# EAGLE design ir_imu (EAGLE 4.16)
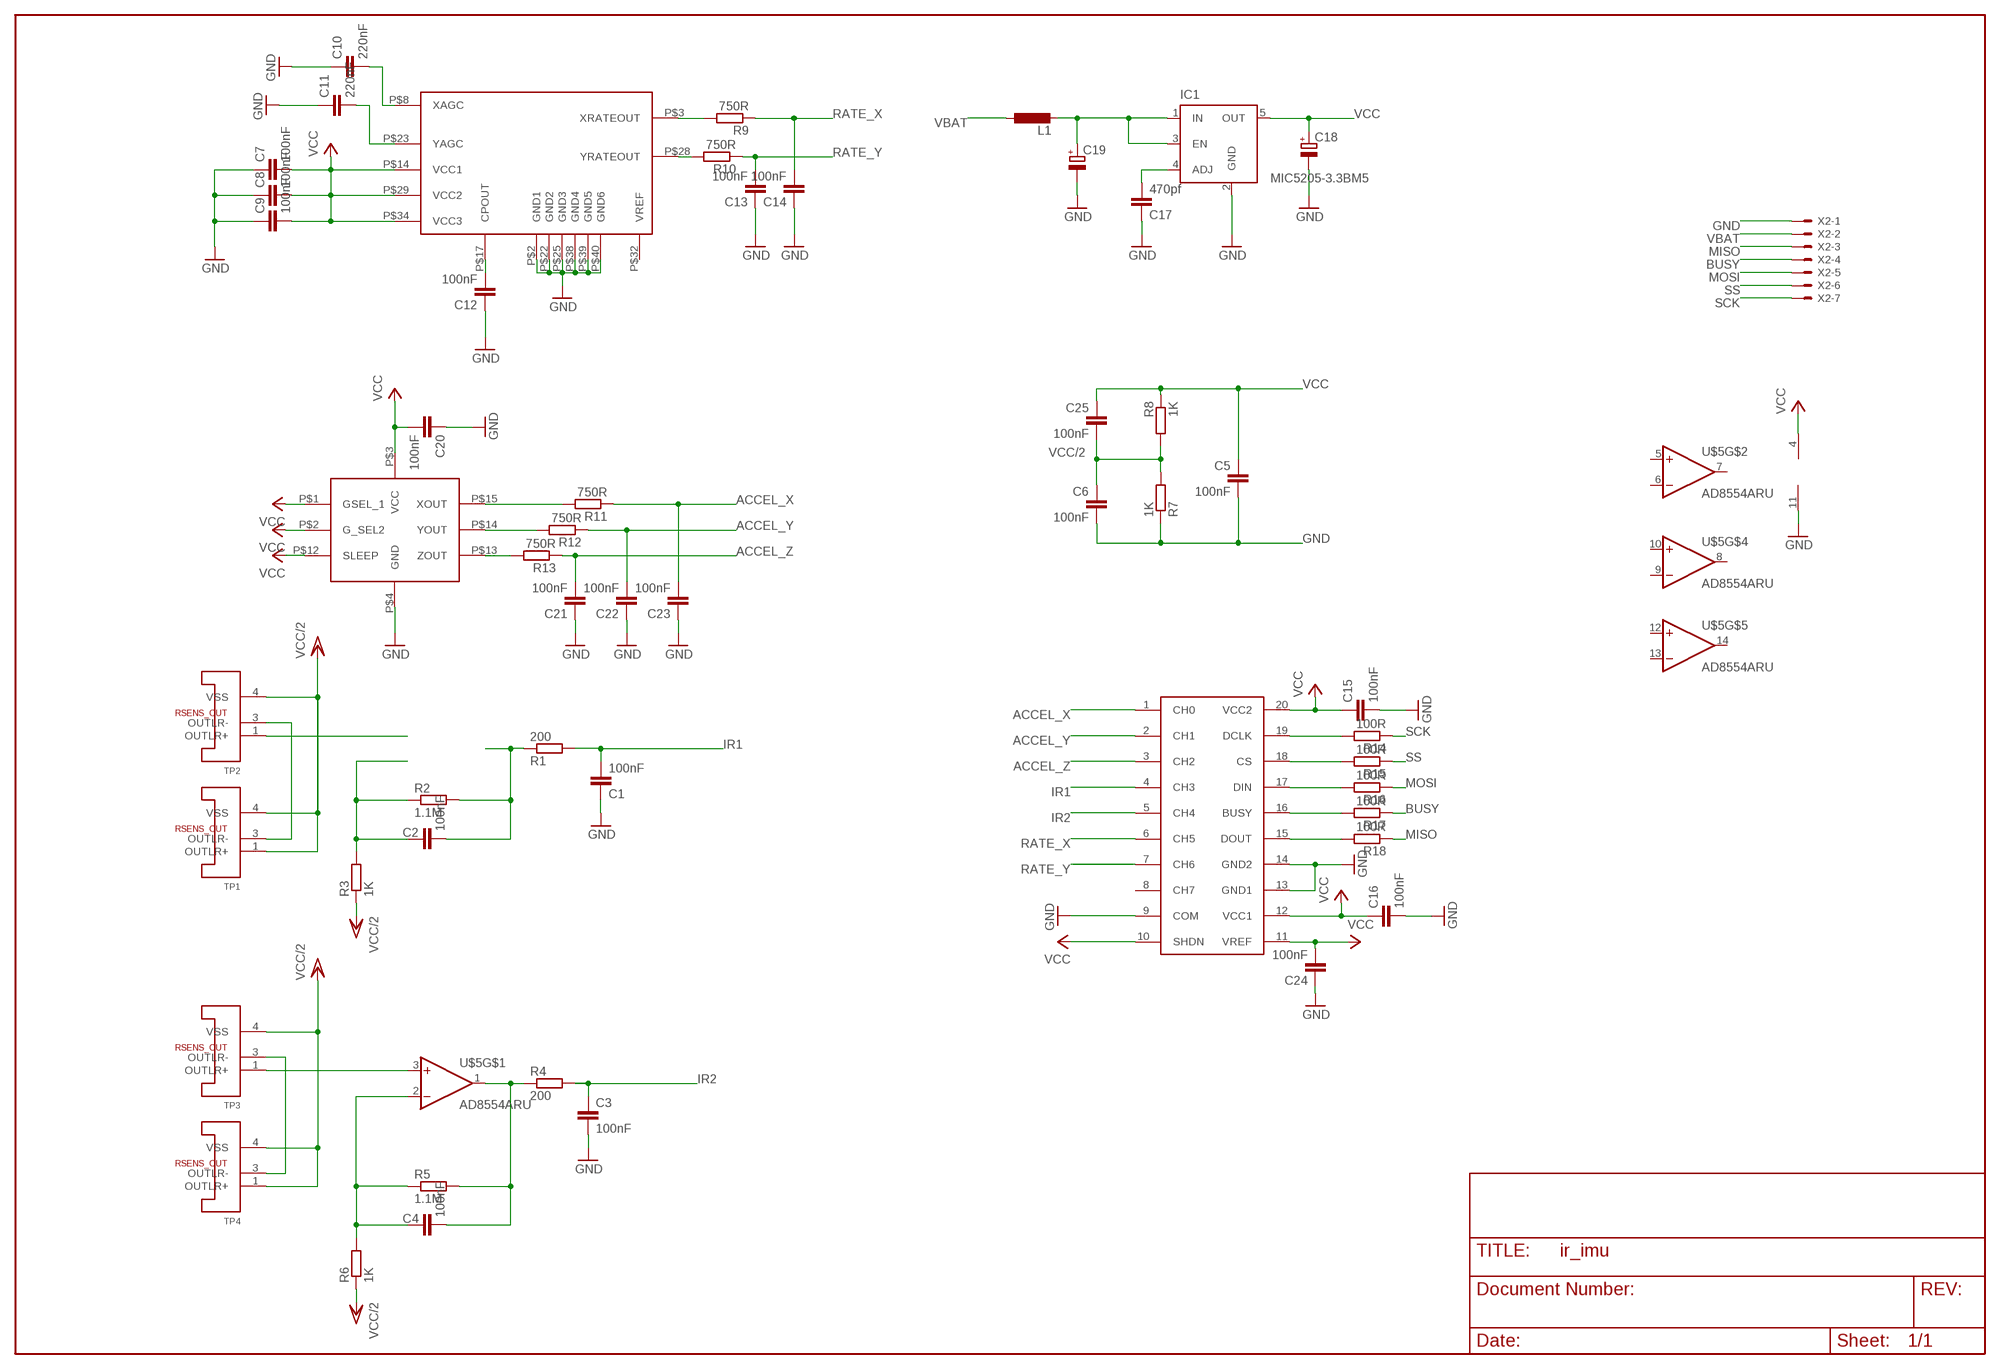
[diagram p0: schematic, sheet 1]

## Parts
C1  100nF  C-EUC0402K  [C0402K]
C2  100nF  C-EUC0402K  [C0402K]
C3  100nF  C-EUC0402K  [C0402K]
C4  100nF  C-EUC0402K  [C0402K]
C5  100nF  C-EUC0402K  [C0402K]
C6  100nF  C-EUC0402K  [C0402K]
C7  100nF  C-EUC0402K  [C0402K]
C8  100nF  C-EUC0402K  [C0402K]
C9  100nF  C-EUC0402K  [C0402K]
C10  220nF  C-EUC0402K  [C0402K]
C11  220nF  C-EUC0402K  [C0402K]
C12  100nF  C-EUC0402K  [C0402K]
C13  100nF  C-EUC0402K  [C0402K]
C14  100nF  C-EUC0402K  [C0402K]
C15  100nF  C-EUC0402K  [C0402K]
C16  100nF  C-EUC0402K  [C0402K]
C17  470pf  C-EUC0402K  [C0402K]
C18  CPOL-EUSMCA  [SMC_A]
C19  CPOL-EUSMCA  [SMC_A]
C20  100nF  C-EUC0402K  [C0402K]
C21  100nF  C-EUC0402K  [C0402K]
C22  100nF  C-EUC0402K  [C0402K]
C23  100nF  C-EUC0402K  [C0402K]
C24  100nF  C-EUC0402K  [C0402K]
C25  100nF  C-EUC0402K  [C0402K]
IC1  MIC5205-3.3BM5  MIC5219BM5  [SOT23-5]
L1  L-EUL2012C  [L2012C]
R1  200  R-EU_R0402  [R0402]
R2  1.1M  R-EU_R0402  [R0402]
R3  1K  R-EU_R0402  [R0402]
R4  200  R-EU_R0402  [R0402]
R5  1.1M  R-EU_R0402  [R0402]
R6  1K  R-EU_R0402  [R0402]
R7  1K  R-EU_R0402  [R0402]
R8  1K  R-EU_R0402  [R0402]
R9  750R  R-EU_R0402  [R0402]
R10  750R  R-EU_R0402  [R0402]
R11  750R  R-EU_R0402  [R0402]
R12  750R  R-EU_R0402  [R0402]
R13  750R  R-EU_R0402  [R0402]
R14  100R  R-EU_R0402  [R0402]
R15  100R  R-EU_R0402  [R0402]
R16  100R  R-EU_R0402  [R0402]
R17  100R  R-EU_R0402  [R0402]
R18  100R  R-EU_R0402  [R0402]
TP1  MLX90247TO39H_SMD  [TO39H_SMD]
TP2  MLX90247TO39H_SMD  [TO39H_SMD]
TP3  MLX90247TO39H_SMD  [TO39H_SMD]
TP4  MLX90247TO39H_SMD  [TO39H_SMD]
U$2  IDG300  [IDG300]
U$3  ADS8344  [SSOP20]
U$4  MMA7260  [CASE162201]
U$5  AD8554ARU  [TSSOP14]
X2  53047-07  [53047-07]

## Nets
ACCEL_X: C23.2 R11.1 U$3.1(CH0)
ACCEL_Y: C22.2 R12.1 U$3.2(CH1)
ACCEL_Z: C21.2 R13.1 U$3.3(CH2)
BUSY: R17.1 X2.4
FOO1: C19.+ IC1.1(IN) IC1.3(EN) L1.2
GND: C1.1 C3.2 C5.2 C6.2 C7.1 C8.1 C9.1 C10.1 C11.1 C12.1 C13.1 C14.1 C15.2 C16.2 C17.1 C18.- C19.- C20.1 C21.1 C22.1 C23.1 C24.1 IC1.2(GND) R7.1 U$2.P$2(GND1) U$2.P$22(GND2) U$2.P$25(GND3) U$2.P$38(GND4) U$2.P$39(GND5) U$2.P$40(GND6) U$3.9(COM) U$3.13(GND1) U$3.14(GND2) U$4.P$4(GND) U$5.11(V-) X2.1
IR1: C1.2 R1.2 U$3.4(CH3)
IR2: C3.1 R4.2 U$3.5(CH4)
MISO: R18.1 X2.3
MOSI: R16.1 X2.5
N$1: TP3.3(OUTLR-) TP4.3(OUTLR-)
N$2: R14.2 U$3.19(DCLK)
N$3: TP2.1(OUTLR+)
N$4: R15.2 U$3.18(CS)
N$5: C11.2 U$2.P$23(YAGC)
N$6: C2.2 R1.1 R2.2
N$7: C2.1 R2.1 R3.2
N$8: C4.2 R4.1 R5.2 U$5.1(OUT)
N$9: C10.2 U$2.P$8(XAGC)
N$10: R9.2 U$2.P$3(XRATEOUT)
N$11: TP3.1(OUTLR+) U$5.3(+IN)
N$12: R10.2 U$2.P$28(YRATEOUT)
N$13: R11.2 U$4.P$15(XOUT)
N$14: R12.2 U$4.P$14(YOUT)
N$15: C12.2 U$2.P$17(CPOUT)
N$16: C17.2 IC1.4(ADJ)
N$17: R16.2 U$3.17(DIN)
N$18: R13.2 U$4.P$13(ZOUT)
N$19: TP1.3(OUTLR-) TP2.3(OUTLR-)
N$20: R17.2 U$3.16(BUSY)
N$21: R18.2 U$3.15(DOUT)
N$125: C4.1 R5.1 R6.2 U$5.2(-IN)
RATE_X: C14.2 R9.1 U$3.6(CH5)
RATE_Y: C13.2 R10.1 U$3.7(CH6)
SCK: R14.1 X2.7
SS: R15.1 X2.6
VBAT: L1.1 X2.2
VCC: C5.1 C7.2 C8.2 C9.2 C15.1 C16.1 C18.+ C20.2 C24.2 C25.1 IC1.5(OUT) R8.1 U$2.P$14(VCC1) U$2.P$29(VCC2) U$2.P$34(VCC3) U$3.10(SHDN) U$3.11(VREF) U$3.12(VCC1) U$3.20(VCC2) U$4.P$1(GSEL_1) U$4.P$2(G_SEL2) U$4.P$3(VCC) U$4.P$12(SLEEP) U$5.4(V+)
VCC/2: C6.1 C25.2 R3.1 R6.1 R7.2 R8.2 TP1.1(OUTLR+) TP1.4(VSS) TP2.4(VSS) TP3.4(VSS) TP4.1(OUTLR+) TP4.4(VSS)
Unconnected: U$2.P$32(VREF) U$3.8(CH7) U$5.5(+IN) U$5.6(-IN) U$5.7(OUT) U$5.8(OUT) U$5.9(-IN) U$5.10(+IN) U$5.12(+IN) U$5.13(-IN) U$5.14(OUT)

## Library data of the parts
C1-C17 C20-C25 = rcl:C-EU: CAPACITOR, European symbol
C18 C19 = rcl:CPOL-EU: POLARIZED CAPACITOR, European symbol
IC1 = v-reg-micrel:MIC5219BM5: VOLTAGE REGULATOR
L1 = rcl:L-EU: INDUCTOR, European symbol
R1-R18 = rcl:R-EU_: RESISTOR, European symbol
TP1-TP4 = paparazzi:MLX90247: Thermopile sensor
U$2 = paparazzi:IDG300
U$3 = paparazzi:ADS8344
U$4 = paparazzi:MMA7260: 3 axis accelerometer
U$5 = paparazzi:AD8554: quad opamp
X2 = con-molex:53?-07: CONNECTOR wire to board 1.25 mm (.049 inch) pitch header

## Board
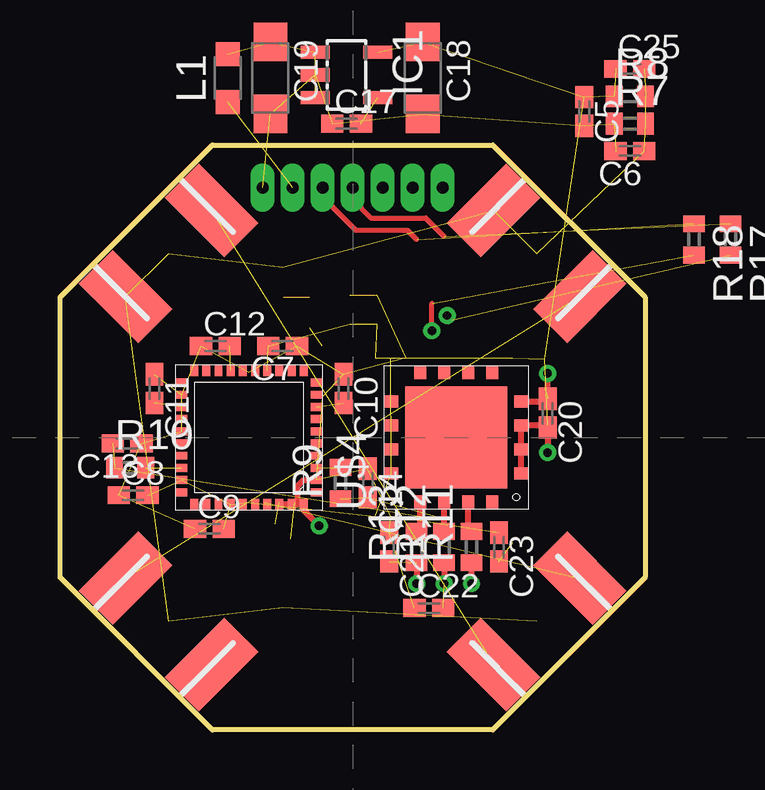
[diagram p1: board, top side]
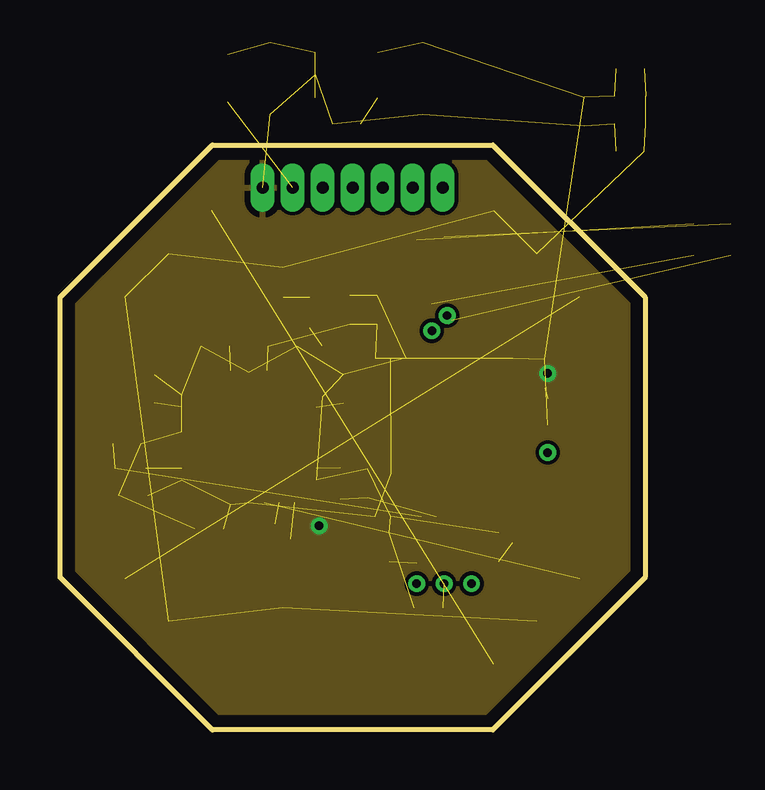
[diagram p2: board, inner layer Route2]
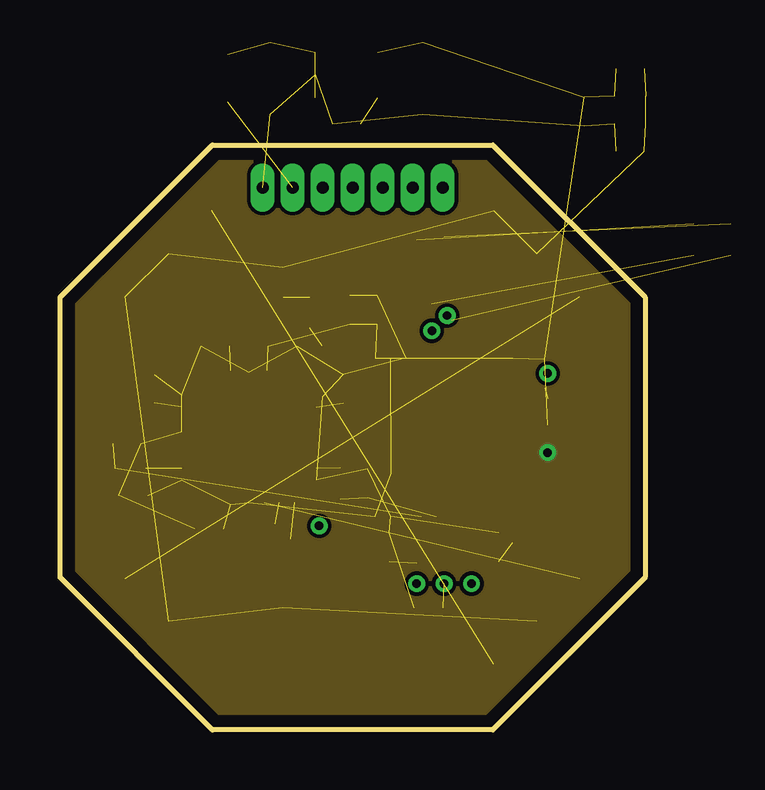
[diagram p3: board, inner layer Route15]
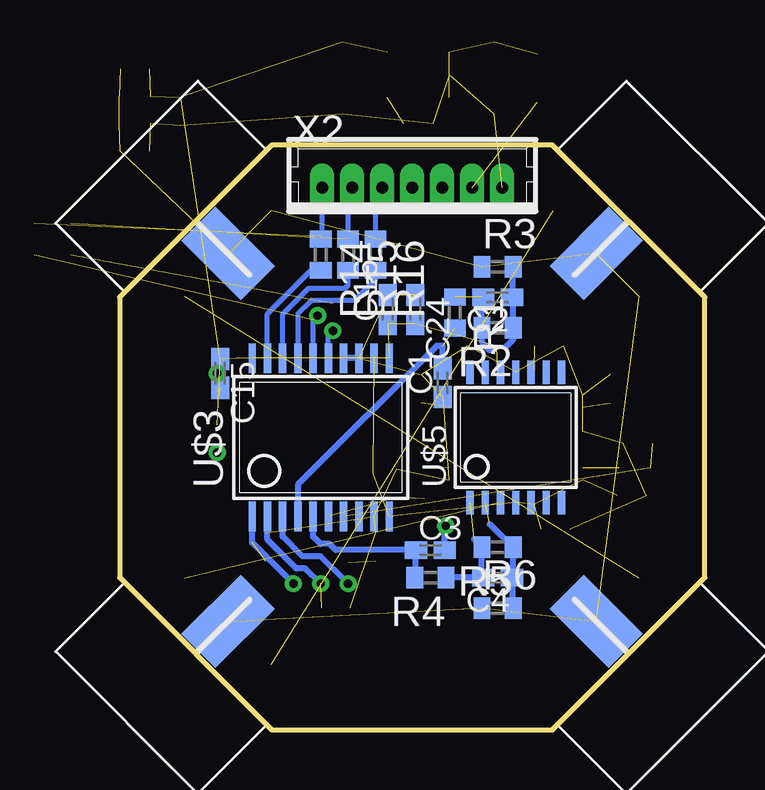
[diagram p4: board, bottom side, seen from below]

Size 24.38 x 24.38 mm. Coordinates in mm from the lower left corner, seen from the top.
Outline: 0,6.35 0,18.03 6.35,24.38 18.03,24.38 24.38,18.03 24.38,6.35 18.03,0 6.35,0 0,6.35
Copper layers (1*2+15*16): Top 0.035mm / dielectric 0.2mm / Route2 0.035mm / dielectric 1.5mm / Route15 0.035mm / dielectric 0.2mm / Bottom 0.035mm
Design rules "eurocircuits_verified_4l": minimum track width 0.15mm, minimum drill 0.35mm, track to track 0.15mm, track to pad 0.15mm, pad to pad 0.15mm, via to via 0.15mm, smd to smd 0.15mm, copper to edge 20mil, drill to drill 8mil, minimum pad ring 10mil, minimum via ring 7mil, stop-mask expansion 4mil, vias tented up to drill 0mil, thermal gap 10mil

### Footprints (pad centres in the part's own frame; a part is rotated, then mirrored left to right if it is on the bottom)
C0402K = smd 0.925 x 0.74: 1 -0.6,0; 2 0.6,0
SMC_A = smd 1.6 x 1.4: + -1.5,0; - 1.5,0
SOT23-5 = smd 0.55 x 1.2: 1 -0.95,-1.3; 2 0,-1.3; 3 0.95,-1.3; 4 0.95,1.3; 5 -0.95,1.3
L2012C = smd 1 x 1: 1 -1,0; 2 1,0
R0402 = smd 0.7 x 0.9: 1 -0.65,0; 2 0.65,0
TO39H_SMD = smd 2 x 3.5 bottom: 1 2.54,-1.905; 3 -2.54,-1.905 | smd 2 x 3.5: 4 0,-1.905
IDG300 = smd 0.457 x 0.33: P$1 -2.794,2.286; P$2 -2.794,1.778; P$3 -2.794,1.27; P$4 -2.794,0.762; P$5 -2.794,0.254; P$6 -2.794,-0.254; P$7 -2.794,-0.762; P$8 -2.794,-1.27; P$9 -2.794,-1.778; P$10 -2.794,-2.286; P$21 2.794,-2.286; P$22 2.794,-1.778; P$23 2.794,-1.27; P$24 2.794,-0.762; P$25 2.794,-0.254; P$26 2.794,0.254; P$27 2.794,0.762; P$28 2.794,1.27; P$29 2.794,1.778; P$30 2.794,2.286 | smd 0.33 x 0.457: P$11 -2.286,-2.794; P$12 -1.778,-2.794; P$13 -1.27,-2.794; P$14 -0.762,-2.794; P$15 -0.254,-2.794; P$16 0.254,-2.794; P$17 0.762,-2.794; P$18 1.27,-2.794; P$19 1.778,-2.794; P$20 2.286,-2.794; P$31 2.286,2.794; P$32 1.778,2.794; P$33 1.27,2.794; P$34 0.762,2.794; P$35 0.254,2.794; P$36 -0.254,2.794; P$37 -0.762,2.794; P$38 -1.27,2.794; P$39 -1.778,2.794; P$40 -2.286,2.794
SSOP20 = smd 0.305 x 1.245: 1 -2.857,-3.302; 2 -2.222,-3.302; 3 -1.587,-3.302; 4 -0.952,-3.302; 5 -0.317,-3.302; 6 0.318,-3.302; 7 0.953,-3.302; 8 1.588,-3.302; 9 2.223,-3.302; 10 2.858,-3.302; 11 2.858,3.302; 12 2.223,3.302; 13 1.588,3.302; 14 0.953,3.302; 15 0.318,3.302; 16 -0.317,3.302; 17 -0.952,3.302; 18 -1.587,3.302; 19 -2.222,3.302; 20 -2.857,3.302
CASE162201 = smd 0.5 x 0.55: P$1 -1.5,-2.7; P$2 -0.5,-2.7; P$3 0.5,-2.7; P$4 1.5,-2.7; P$9 1.5,2.7; P$10 0.5,2.7; P$11 -0.5,2.7; P$12 -1.5,2.7 | smd 0.55 x 0.5: P$5 2.7,-1.5; P$6 2.7,-0.5; P$7 2.7,0.5; P$8 2.7,1.5; P$13 -2.7,1.5; P$14 -2.7,0.5; P$15 -2.7,-0.5; P$16 -2.7,-1.5 | smd 4.25 x 4.25: P$17 0,0
TSSOP14 = smd 0.305 x 0.991: 1 -1.905,-2.718; 2 -1.27,-2.718; 3 -0.635,-2.718; 4 0,-2.718; 5 0.635,-2.718; 6 1.27,-2.718; 7 1.905,-2.718; 8 1.905,2.718; 9 1.27,2.718; 10 0.635,2.718; 11 0,2.718; 12 -0.635,2.718; 13 -1.27,2.718; 14 -1.905,2.718
53047-07 = drill 0.5 pad 0.698 long: 1 3.75,0; 2 2.5,0; 3 1.25,0; 4 0,0; 5 -1.25,0; 6 -2.5,0; 7 -3.75,0

### Placement (x,y rotation side)
C1  10.92,14.48 90 bottom
C2  8.64,18.03 180 bottom
C3  11.43,7.49 0 bottom
C4  8.64,6.35 180 bottom
C5  21.84,25.78 270 top
C6  23.75,24.13 180 top
C7  9.27,16 180 top
C8  3.05,9.78 0 top
C9  6.22,8.38 0 top
C10  11.81,14.22 270 top
C11  3.94,14.22 270 top
C12  6.48,16 0 top
C13  2.79,11.94 180 top
C14  12.83,10.29 270 top
C15  20.19,14.86 270 bottom
C16  13.21,17.53 90 bottom
C17  11.94,25.27 0 top
C18  15.11,27.18 270 top
C19  8.76,27.18 270 top
C20  20.32,13.21 270 top
C21  13.72,7.62 270 top
C22  15.37,5.08 0 top
C23  18.29,7.62 270 top
C24  12.06,17.53 270 bottom
C25  23.75,27.56 0 top  (outside the outline)
IC1  11.94,27.3 270 top
L1  6.98,27.18 90 top
R1  10.41,17.4 270 bottom
R2  8.64,16.76 180 bottom
R3  8.64,19.3 0 bottom
R4  11.43,6.35 180 bottom
R5  8.64,7.62 180 bottom
R6  8.64,5.08 0 bottom
R7  23.75,25.27 0 top
R8  23.75,26.42 0 top
R9  11.68,10.29 90 top
R10  2.92,10.92 0 top
R11  17.14,7.62 90 top
R12  16,7.62 90 top
R13  14.86,7.62 90 top
R14  16,19.81 270 bottom
R15  14.86,19.81 270 bottom
R16  13.72,19.81 270 bottom
R17  27.94,20.45 270 top  (outside the outline)
R18  26.42,20.45 270 top
TP1  21.21,21.21 45 bottom
TP2  3.17,3.18 225 bottom
TP3  21.21,3.18 135 bottom
TP4  3.17,21.21 315 bottom
U$2  7.87,12.19 180 top
U$3  16,12.19 0 bottom
U$4  16.51,12.19 90 top
U$5  7.87,12.19 0 bottom
X2  12.19,22.61 0 bottom

### Tracks (layer width: path | path; a pad name or v marks a point on that pad's centre or on a via)
ACCEL_X  (via drill 0.35)  (1 unrouted)
  Top 0.254: R11.1 v17.14,6.1
  Bottom 0.254: U$3.1 18.86,7.81 v17.14,6.1
ACCEL_Y  (via drill 0.35)  (1 unrouted)
  Top 0.254: R12.1 v16,6.1
  Bottom 0.254: U$3.2 18.22,7.94 17.02,6.73 16.64,6.73 v16,6.1
ACCEL_Z  (via drill 0.35)  (1 unrouted)
  Top 0.254: R13.1 v14.86,6.1
  Bottom 0.254: 14.99,6.22 15.05,6.22 | U$3.3 17.59,8.06 16.76,7.24 16,7.24 14.99,6.22 | v14.86,6.1 14.99,6.22
BUSY  (1 unrouted)
  Top 0.203: X2.4 12.19,22.1 12.95,21.34 15.24,21.34 16,20.57
FOO1  (3 unrouted)
GND  (via drill 0.35)  (27 unrouted)
  Top 0.254: U$4.P$4 20.32,13.69 C20.1 v20.32,14.86 | U$2.P$38 U$2.P$39 9.91,9.4 | v10.79,8.51 10.16,9.14 U$2.P$40 9.91,9.4 | U$2.P$2 10.16,10.41 9.91,10.16 9.91,9.4
  Bottom 0.254: C3.2 10.83,8.47 v10.79,8.51 | U$3.13 U$3.14
  pour Route2: -5.33,29.59 29.72,29.59 29.72,-5.08 -5.33,-5.08
IR1  (1 unrouted)
  Bottom 0.254: U$3.4 16.95,10.22 11.18,16 10.92,16 C1.2
IR2
  Bottom 0.254: R4.2 12.06,6.37 12.06,7.49 | U$3.5 16.32,8.06 16,7.75 15.62,7.75 15.37,7.49 12.06,7.49 | C3.1 12.06,7.49
MISO  (1 unrouted)
  Top 0.203: X2.3 10.94,22.2 12.32,20.83 14.48,20.83 14.86,20.45
MOSI
  Bottom 0.203: 13.72,20.45 R16.1 13.72,22.33 X2.5
N$1  (1 unrouted)
N$2
  Bottom 0.203: R14.2 16.4,19.16 18.22,17.34 U$3.19
N$4
  Bottom 0.203: R15.2 14.86,18.54 14.99,18.41 16.51,18.41 17.59,17.34 U$3.18
N$5  (1 unrouted)
N$6  (1 unrouted)
  Bottom 0.254: 8.96,15.82 9.27,16.13 9.27,16.76 R2.2 9.29,18.02 | C2.2 9.27,18.03 9.29,18.02 | 9.29,18.02 9.3,18.03
N$7
  Bottom 0.254: 8.31,15.95 8,16.26 R2.1 7.99,18.02 8,18.03 C2.1 8,18.07 R3.2
N$8  (1 unrouted)
  Bottom 0.254: 9.61,7.96 9.27,7.62 R5.2 9.29,6.37 9.27,6.35 C4.2 R4.1 10.79,6.35
N$9  (1 unrouted)
N$10  (1 unrouted)
N$11  (1 unrouted)
N$12  (1 unrouted)
N$13
  Top 0.254: R11.2 17.14,8.26 17.01,8.39 U$4.P$15
N$14
  Top 0.254: R12.2 16,8.26 R12.2 U$4.P$14
N$15  (1 unrouted)
N$16  (1 unrouted)
N$17
  Bottom 0.203: U$3.17 16.95,17.34 16.38,17.91 14.61,17.91 13.72,18.8 R16.2
N$18
  Top 0.254: R13.2 14.86,8.26 15.01,8.41 U$4.P$13
N$19  (1 unrouted)
N$20  (via drill 0.35)  (1 unrouted)
  Top 0.203: v16.13,17.27 16,17.4
  Bottom 0.203: U$3.16 16.32,17.08 v16.13,17.27
N$21  (via drill 0.35)  (1 unrouted)
  Top 0.203: v15.49,16.64 15.49,17.78
  Bottom 0.203: U$3.15 15.68,16.45 v15.49,16.64
N$125  (1 unrouted)
  Bottom 0.254: 8.96,8.58 R5.1 7.99,6.37 8,6.35 C4.1 8,6.31 R6.2
RATE_X  (2 unrouted)
RATE_Y  (2 unrouted)
SCK
  Bottom 0.203: R14.1 16,20.45 15.94,20.51 X2.7
SS
  Bottom 0.203: X2.6 14.86,22.44 R15.1
VBAT  (1 unrouted)
VCC  (via drill 0.35)  (20 unrouted)
  Top 0.254: U$4.P$3 19.18,12.7 | U$4.P$3 U$4.P$2 | U$4.P$3 20.32,12.7 C20.2 v20.32,11.56 | U$4.P$2 | U$4.P$2 19.18,11.68 | U$4.P$1 19.21,10.79 | 19.21,10.79 U$4.P$2 | 19.21,10.79 19.18,10.79
  pour Route15: -5.08,29.34 29.46,29.34 29.46,-4.95 -5.08,-4.95
VCC/2  (11 unrouted)